# Altium schematic sheet Sheet1.SchDoc
size A4
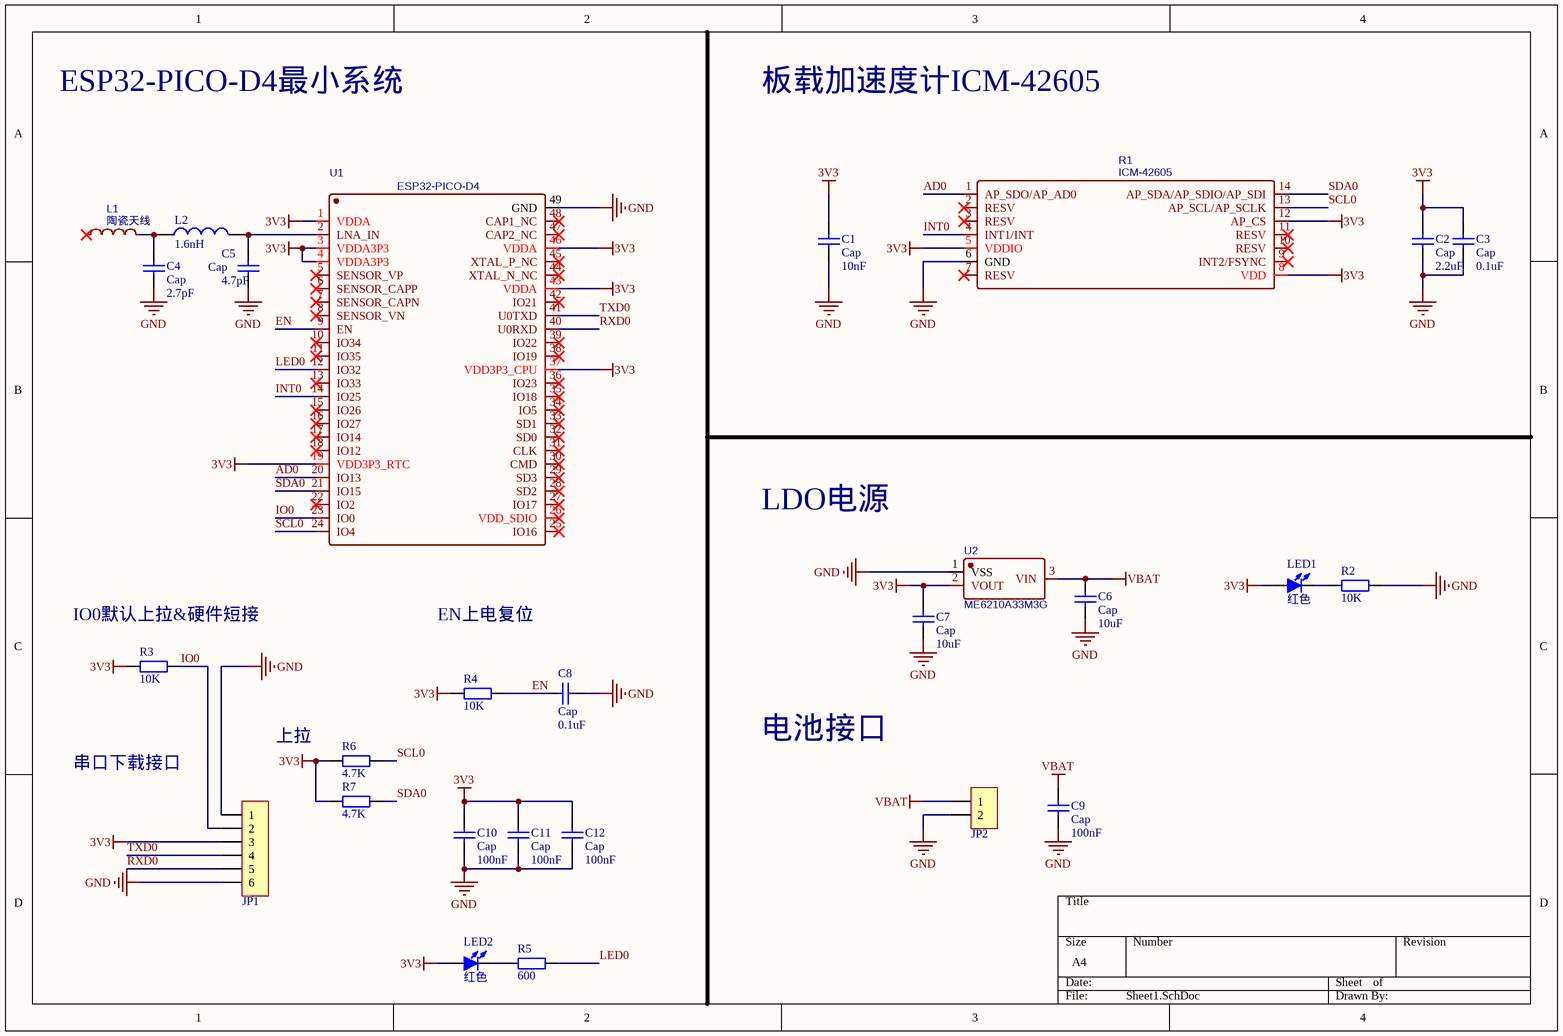
[diagram p0: Sheet1.SchDoc]

## Parts
C1  Cap  value 10nF  [C 0402_L]
C2  Cap  value 2.2uF  [C 0402_L]
C3  Cap  value 0.1uF  [C 0402_L]
C4  Cap  value 2.7pF  [C 0402_L]
C5  Cap  value 4.7pF  [C 0402_L]
C6  Cap  value 10uF  [C 0402_L]
C7  Cap  value 10uF  [C 0402_L]
C8  Cap  value 0.1uF  [C 0402_L]
C9  Cap  value 100nF  [C 0402_L]
C10  Cap  value 100nF  [C 0402_L]
C11  Cap  value 100nF  [C 0402_L]
C12  Cap  value 100nF  [C 0402_L]
JP1  HDR-1X6  [debug]  (value not drawn)
JP2  HDR-1X2  [电池焊接口]  (value not drawn)
L1  陶瓷天线  [Huaxin]
L2  1.6nH  [L 0402]
LED1  红色  [LED 0805G]
LED2  红色  [LED 0805G]
R1  ICM-42605  [ICM-42605]
R2  10K  [R 0402_L]
R3  10K  [R 0402_L]
R4  10K  [R 0402_L]
R5  600  [R 0402_L]
R6  4.7K  [R 0402_L]
R7  4.7K  [R 0402_L]
U1  ESP32-PICO-D4  [ESP32-PICO-D4]
U2  ME6210A33M3G  [ME6210A33M3G]

## Nets
3V3: C1.2 C2.2 C3.2 C7.2 C10.1 C11.1 C12.1 JP1.3 LED1.1(A) LED2.1(A) R1.5(VDDIO) R1.8(VDD) R1.12(AP_CS) R3.1 R4.1 R6.1 R7.1 U1.1(VDDA) U1.3(VDDA3P3) U1.4(VDDA3P3) U1.19(VDD3P3_RTC) U1.37(VDD3P3_CPU) U1.43(VDDA) U1.46(VDDA) U2.2(VOUT)
GND: C1.1 C2.1 C3.1 C4.2 C5.2 C6.1 C7.1 C8.1 C9.1 C10.2 C11.2 C12.2 JP1.1 JP1.6 JP2.2 R1.6(GND) R2.2 U1.49(GND) U2.1(VSS)
VBAT: C6.2 C9.2 JP2.1 U2.3(VIN)
AD0: R1.1(AP_SDO/AP_AD0) U1.20(IO13)
EN: C8.2 R4.2 U1.9(EN)
INT0: R1.4(INT1/INT) U1.14(IO25)
IO0: JP1.2 R3.2 U1.23(IO0)
LED0: R5.2 U1.12(IO32)
RXD0: JP1.5 U1.40(U0RXD)
SCL0: R1.13(AP_SCL/AP_SCLK) R6.2 U1.24(IO4)
SDA0: R1.14(AP_SDA/AP_SDIO/AP_SDI) R7.2 U1.21(IO15)
TXD0: JP1.4 U1.41(U0TXD)
NetC4_1: C4.1 L1.2 L2.1
NetC5_1: C5.1 L2.2 U1.2(LNA_IN)
NetLED1_2: LED1.2(K) R2.1
NetLED2_2: LED2.2(K) R5.1

Not connected (* = marked no-connect by the designer): L1 1*; R1 2(RESV)* 3(RESV)* 7(RESV)* 9(INT2/FSYNC)* 10(RESV)* 11(RESV)*; U1 5(SENSOR_VP)* 6(SENSOR_CAPP)* 7(SENSOR_CAPN)* 8(SENSOR_VN)* 10(IO34)* 11(IO35)* 13(IO33)* 15(IO26)* 16(IO27)* 17(IO14)* 18(IO12)* 22(IO2)* 25(IO16)* 26(VDD_SDIO)* 27(IO17)* 28(SD2)* 29(SD3)* 30(CMD)* 31(CLK)* 32(SD0)* 33(SD1)* 34(IO5)* 35(IO18)* 36(IO23)* 38(IO19)* 39(IO22)* 42(IO21)* 44(XTAL_N_NC)* 45(XTAL_P_NC)* 47(CAP2_NC)* 48(CAP1_NC)*

## Notes on the sheet
- ESP32-PICO-D4最小系统
- 板载加速度计ICM-42605
- LDO电源
- (near R3) IO0默认上拉&硬件短接
- EN上电复位
- 串口下载接口
- 上拉
- 电池接口

## Library data of the parts
C1-C12 = Cap: Capacitor; Published: 8-Jun-2000; LatestRevisionDate: 17-Jul-2002; LatestRevisionNote: Re-released for DXP Platform.; PackageReference: RAD-0.3; Publisher: Altium Limited; PackageDescription: Radial Cap, Thru-Hole; 2 Leads; 0.3 in Pin Spacing
JP1 = Header 6: 6P接插件; 版权归属: 源创客; BOM名称: 6P接插件; 学习资源: www.ooocke.com
JP2 = Header 2: 2P接插件; 版权归属: 源创客; BOM名称: 2P接插件; 学习资源: www.ooocke.com
L1 = Huaxin: BOM_Manufacturer: Huaxin S&T; BOM_Manufacturer Part: RFECA3216060A1T; nameAlias: Value; Contributor: LCSC; BOM_Supplier: LCSC; BOM_Supplier Part: C127620; BOM_JLCPCB Part Class: Extended Part; spicePre: L; spiceSymbolName: RFECA3216060A1T
L2 = L: 小功率贴片电感; 版权归属: 源创客; BOM名称: 小功率贴片电感; 学习资源: www.ooocke.com
LED1 LED2 = LED-SMD: 贴片LED; 版权归属: 源创客; BOM名称: 贴片LED; 学习资源: www.ooocke.com
R1 = ICM-42605: BOM_Manufacturer: InvenSense; Contributor: LCSC; BOM_Supplier: LCSC; BOM_Supplier Part: C2655099; BOM_Manufacturer Part: ICM-42605; BOM_JLCPCB Part Class: Extended Part; spicePre: R; spiceSymbolName: ICM-42605
R2-R7 = R: 贴片电阻; 版权归属: 源创客; BOM名称: 贴片电阻; 学习资源: www.ooocke.com
U1 = ESP32-PICO-D4: BOM_Manufacturer: Espressif Systems; Contributor: LCSC; BOM_Supplier: LCSC; BOM_Supplier Part: C193707; BOM_Manufacturer Part: ESP32-PICO-D4; BOM_JLCPCB Part Class: Extended Part; Frequency: -; spicePre: U; spiceSymbolName: ESP32-PICO-D4
U2 = ME6210A33M3G: BOM_Manufacturer: Nanjing Micro One Elec; Contributor: LCSC; BOM_Supplier: LCSC; BOM_Supplier Part: C236680; BOM_Manufacturer Part: ME6210A33M3G; BOM_JLCPCB Part Class: Extended Part; spicePre: U; spiceSymbolName: ME6210A33M3G